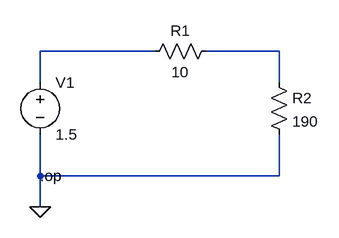
[diagram p0: schematic CIRCUIT 1.asc]
CIRCUIT 1.asc, the LTspice schematic file:
Version 4
SHEET 1 880 680
WIRE 304 96 128 96
WIRE 496 96 384 96
WIRE 128 144 128 96
WIRE 496 144 496 96
WIRE 128 288 128 224
WIRE 496 288 496 224
WIRE 496 288 128 288
WIRE 128 336 128 288
FLAG 128 336 0
SYMBOL voltage 128 128 R0
SYMATTR InstName V1
SYMATTR Value 1.5
SYMATTR SpiceLine Rser=0
SYMBOL res 288 112 R270
WINDOW 0 32 56 VTop 2
WINDOW 3 0 56 VBottom 2
SYMATTR InstName R1
SYMATTR Value 10
SYMBOL res 480 128 R0
SYMATTR InstName R2
SYMATTR Value 190
TEXT 128 288 Left 2 !.op

The netlist it stands for:
* CIRCUIT 1.asc
V1 N001 0 1.5 Rser=0
R1 N001 N002 10
R2 N002 0 190
.op
.backanno
.end